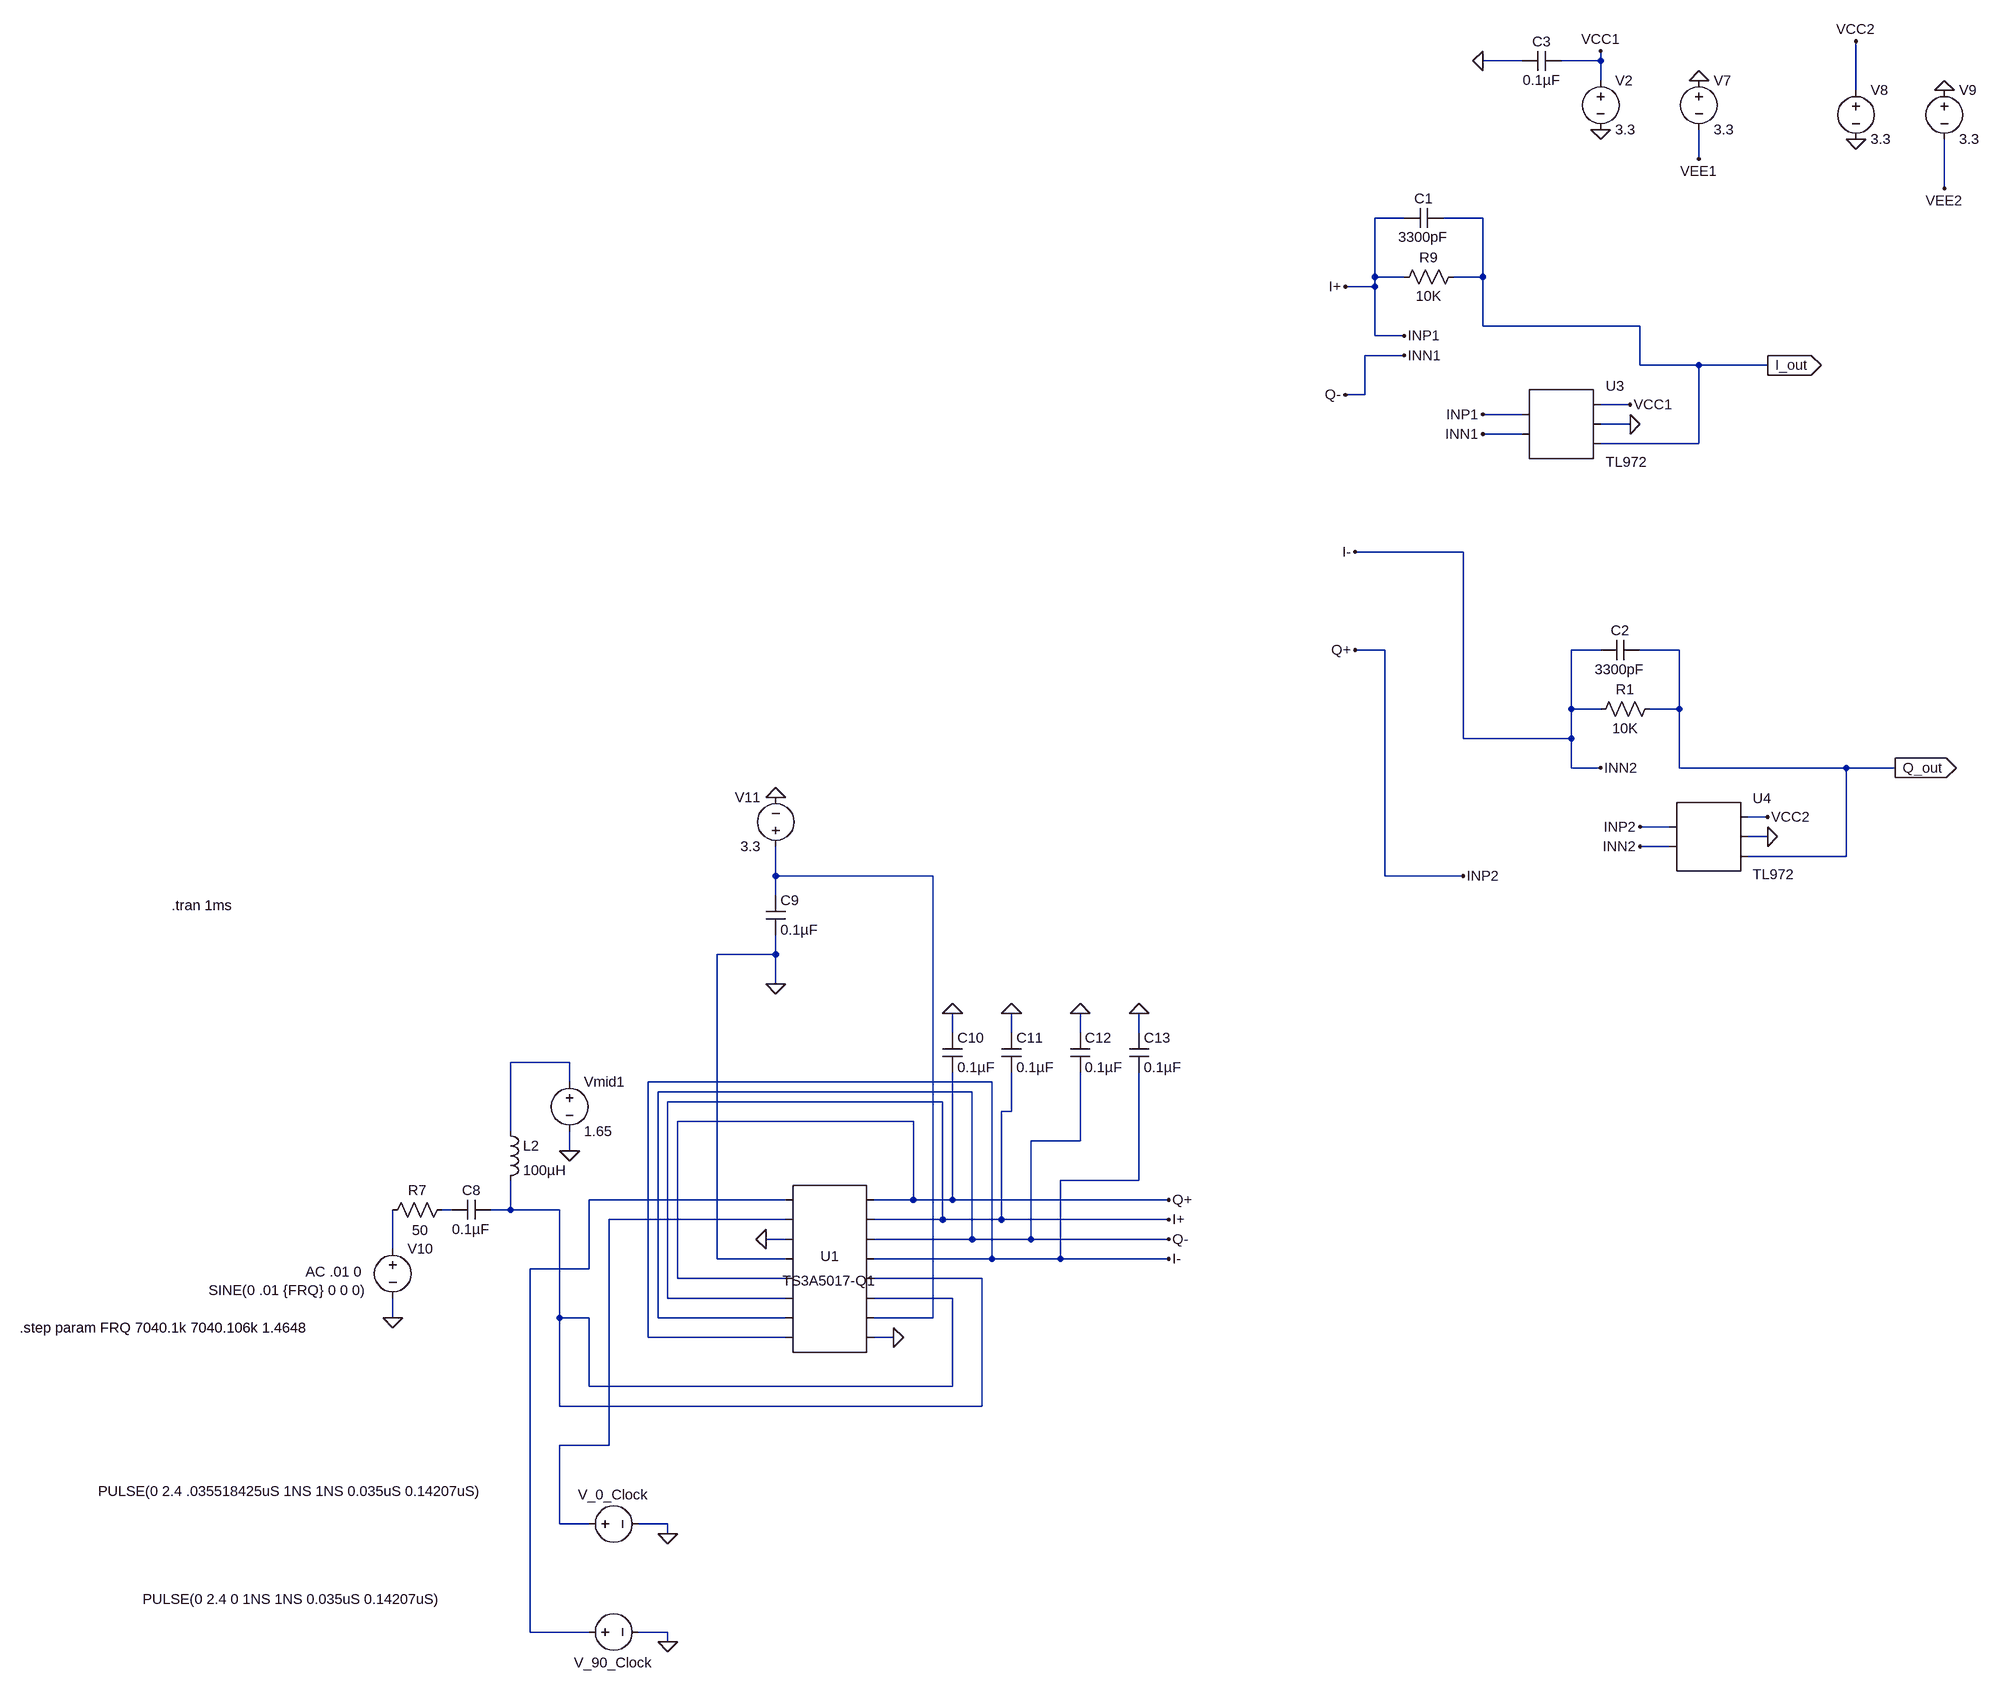
[diagram p0: schematic TS3A5017.asc]
TS3A5017.asc, the LTspice schematic file:
Version 4
SHEET 1 2336 2212
WIRE 224 -416 160 -416
WIRE 352 -416 352 -432
WIRE 352 -416 288 -416
WIRE 352 -384 352 -416
WIRE 768 -368 768 -448
WIRE 512 -256 512 -304
WIRE 912 -208 912 -288
WIRE 32 -160 -16 -160
WIRE 160 -160 96 -160
WIRE -16 -64 -16 -160
WIRE 32 -64 -16 -64
WIRE 160 -64 160 -160
WIRE 160 -64 112 -64
WIRE -16 -48 -16 -64
WIRE -16 -48 -64 -48
WIRE 160 16 160 -64
WIRE 416 16 160 16
WIRE -16 32 -16 -48
WIRE 32 32 -16 32
WIRE 32 64 -32 64
WIRE 416 80 416 16
WIRE 512 80 416 80
WIRE 624 80 512 80
WIRE -32 128 -32 64
WIRE -32 128 -64 128
WIRE 400 144 352 144
WIRE 224 160 160 160
WIRE 400 176 352 176
WIRE 224 192 160 192
WIRE 512 208 512 80
WIRE 512 208 352 208
WIRE 128 384 -48 384
WIRE 0 544 -48 544
WIRE 352 544 304 544
WIRE 480 544 416 544
WIRE 304 640 304 544
WIRE 352 640 304 640
WIRE 480 640 480 544
WIRE 480 640 432 640
WIRE 128 688 128 384
WIRE 304 688 304 640
WIRE 304 688 128 688
WIRE 304 736 304 688
WIRE 352 736 304 736
WIRE 480 736 480 640
WIRE 752 736 480 736
WIRE 832 736 752 736
WIRE 624 816 592 816
WIRE 464 832 416 832
WIRE 624 848 592 848
WIRE 464 864 416 864
WIRE 752 880 752 736
WIRE 752 880 592 880
WIRE -992 912 -992 864
WIRE -736 912 -992 912
WIRE 0 912 0 544
WIRE 128 912 0 912
WIRE -992 944 -992 912
WIRE -992 1040 -992 1008
WIRE -992 1040 -1088 1040
WIRE -992 1088 -992 1040
WIRE -704 1168 -704 1136
WIRE -608 1168 -608 1136
WIRE -496 1168 -496 1136
WIRE -400 1168 -400 1136
WIRE -1328 1216 -1424 1216
WIRE -1328 1248 -1328 1216
WIRE -640 1248 -1200 1248
WIRE -672 1264 -1184 1264
WIRE -720 1280 -1168 1280
WIRE -608 1296 -608 1232
WIRE -608 1296 -624 1296
WIRE -768 1312 -1152 1312
WIRE -1424 1328 -1424 1216
WIRE -496 1344 -496 1232
WIRE -496 1344 -576 1344
WIRE -1328 1360 -1328 1328
WIRE -400 1408 -400 1232
WIRE -400 1408 -528 1408
WIRE -976 1440 -1296 1440
WIRE -768 1440 -768 1312
WIRE -768 1440 -832 1440
WIRE -704 1440 -704 1232
WIRE -704 1440 -768 1440
WIRE -352 1440 -704 1440
WIRE -1520 1456 -1536 1456
WIRE -1424 1456 -1424 1408
WIRE -1424 1456 -1456 1456
WIRE -1344 1456 -1424 1456
WIRE -976 1472 -1264 1472
WIRE -720 1472 -720 1280
WIRE -720 1472 -832 1472
WIRE -624 1472 -624 1296
WIRE -624 1472 -720 1472
WIRE -352 1472 -624 1472
WIRE -976 1504 -1008 1504
WIRE -672 1504 -672 1264
WIRE -672 1504 -832 1504
WIRE -576 1504 -576 1344
WIRE -576 1504 -672 1504
WIRE -352 1504 -576 1504
WIRE -1616 1520 -1616 1456
WIRE -1088 1536 -1088 1040
WIRE -976 1536 -1088 1536
WIRE -640 1536 -640 1248
WIRE -640 1536 -832 1536
WIRE -528 1536 -528 1408
WIRE -528 1536 -640 1536
WIRE -352 1536 -528 1536
WIRE -1296 1552 -1296 1440
WIRE -1296 1552 -1392 1552
WIRE -1152 1568 -1152 1312
WIRE -976 1568 -1152 1568
WIRE -656 1568 -832 1568
WIRE -1168 1600 -1168 1280
WIRE -976 1600 -1168 1600
WIRE -704 1600 -832 1600
WIRE -1616 1632 -1616 1600
WIRE -1344 1632 -1344 1456
WIRE -1296 1632 -1344 1632
WIRE -1184 1632 -1184 1264
WIRE -976 1632 -1184 1632
WIRE -736 1632 -736 912
WIRE -736 1632 -832 1632
WIRE -1200 1664 -1200 1248
WIRE -976 1664 -1200 1664
WIRE -800 1664 -832 1664
WIRE -1296 1744 -1296 1632
WIRE -704 1744 -704 1600
WIRE -704 1744 -1296 1744
WIRE -1344 1776 -1344 1632
WIRE -656 1776 -656 1568
WIRE -656 1776 -1344 1776
WIRE -1264 1840 -1264 1472
WIRE -1264 1840 -1344 1840
WIRE -1344 1968 -1344 1840
WIRE -1296 1968 -1344 1968
WIRE -1168 1968 -1216 1968
WIRE -1168 1984 -1168 1968
WIRE -1392 2144 -1392 1552
WIRE -1296 2144 -1392 2144
WIRE -1168 2144 -1216 2144
WIRE -1168 2160 -1168 2144
FLAG 624 80 I_out
IOPIN 624 80 Out
FLAG 832 736 Q_out
IOPIN 832 736 Out
FLAG 352 -304 0
FLAG 512 -384 0
FLAG 32 32 INP1
FLAG 160 192 INN1
FLAG 32 64 INN1
FLAG 160 160 INP1
FLAG 352 -432 VCC1
FLAG 400 144 VCC1
FLAG 512 -256 VEE1
FLAG 352 736 INN2
FLAG 416 864 INN2
FLAG 416 832 INP2
FLAG 128 912 INP2
FLAG 768 -288 0
FLAG 912 -368 0
FLAG 768 -448 VCC2
FLAG 624 816 VCC2
FLAG 912 -208 VEE2
FLAG -1616 1632 0
FLAG -1328 1360 0
FLAG -800 1664 0
FLAG -1008 1504 0
FLAG -704 1136 0
FLAG -608 1136 0
FLAG -496 1136 0
FLAG -400 1136 0
FLAG -352 1440 Q+
FLAG -352 1472 I+
FLAG -352 1504 Q-
FLAG -352 1536 I-
FLAG -1168 1984 0
FLAG -1168 2160 0
FLAG -64 -48 I+
FLAG -48 384 I-
FLAG -48 544 Q+
FLAG -64 128 Q-
FLAG -992 784 0
FLAG 160 -416 0
FLAG -992 1088 0
FLAG 400 176 0
FLAG 624 848 0
SYMBOL cap 96 -176 R90
WINDOW 0 0 32 VBottom 2
WINDOW 3 32 32 VTop 2
SYMATTR InstName C1
SYMATTR Value 3300pF
SYMBOL res 128 -80 R90
WINDOW 0 0 56 VBottom 2
WINDOW 3 32 56 VTop 2
SYMATTR InstName R9
SYMATTR Value 10K
SYMATTR SpiceLine tol=1
SYMBOL cap 416 528 R90
WINDOW 0 0 32 VBottom 2
WINDOW 3 32 32 VTop 2
SYMATTR InstName C2
SYMATTR Value 3300pF
SYMBOL res 448 624 R90
WINDOW 0 0 56 VBottom 2
WINDOW 3 32 56 VTop 2
SYMATTR InstName R1
SYMATTR Value 10K
SYMATTR SpiceLine tol=1
SYMBOL AutoGenerated\\TL972 288 176 R0
SYMATTR InstName U3
SYMBOL AutoGenerated\\TL972 528 848 R0
SYMATTR InstName U4
SYMBOL voltage 352 -400 R0
WINDOW 123 0 0 Left 0
WINDOW 39 0 0 Left 0
SYMATTR InstName V2
SYMATTR Value 3.3
SYMBOL voltage 512 -400 R0
WINDOW 123 0 0 Left 0
WINDOW 39 0 0 Left 0
SYMATTR InstName V7
SYMATTR Value 3.3
SYMBOL voltage 768 -384 R0
WINDOW 123 0 0 Left 0
WINDOW 39 0 0 Left 0
SYMATTR InstName V8
SYMATTR Value 3.3
SYMBOL voltage 912 -384 R0
WINDOW 123 0 0 Left 0
WINDOW 39 0 0 Left 0
SYMATTR InstName V9
SYMATTR Value 3.3
SYMBOL voltage -1616 1504 R0
WINDOW 123 -142 53 Left 2
WINDOW 39 0 0 Left 0
WINDOW 3 -300 83 Left 2
SYMATTR Value2 AC .01 0
SYMATTR Value SINE(0 .01 {FRQ} 0 0 0)
SYMATTR InstName V10
SYMBOL res -1520 1440 R90
WINDOW 0 0 56 VBottom 2
WINDOW 3 34 51 VTop 2
SYMATTR InstName R7
SYMATTR Value 50
SYMBOL ind -1440 1312 R0
SYMATTR InstName L2
SYMATTR Value 100µH
SYMBOL cap -1456 1440 R90
WINDOW 0 0 32 VBottom 2
WINDOW 3 32 32 VTop 2
SYMATTR InstName C8
SYMATTR Value 0.1µF
SYMBOL voltage -1328 1232 R0
SYMATTR InstName Vmid1
SYMATTR Value 1.65
SYMATTR SpiceLine Rser=10
SYMBOL AutoGenerated\\TS3A5017-Q1 -912 1552 R0
SYMATTR InstName U1
SYMATTR ModelFile C:\Users\EG\Downloads\scdm196\TS3A5017_Q1_TINA_AIO\ts3a5017-q1.lib
SYMBOL voltage -992 880 R180
WINDOW 0 24 96 Left 2
WINDOW 3 24 16 Left 2
WINDOW 123 0 0 Left 0
WINDOW 39 0 0 Left 0
SYMATTR InstName V11
SYMATTR Value 3.3
SYMBOL cap -1008 944 R0
SYMATTR InstName C9
SYMATTR Value 0.1µF
SYMBOL cap -720 1168 R0
SYMATTR InstName C10
SYMATTR Value 0.1µF
SYMBOL cap -624 1168 R0
SYMATTR InstName C11
SYMATTR Value 0.1µF
SYMBOL cap -512 1168 R0
SYMATTR InstName C12
SYMATTR Value 0.1µF
SYMBOL cap -416 1168 R0
SYMATTR InstName C13
SYMATTR Value 0.1µF
SYMBOL voltage -1312 1968 R270
WINDOW 0 32 56 VTop 2
WINDOW 3 -107 -464 VBottom 2
WINDOW 123 0 0 Left 0
WINDOW 39 0 0 Left 0
SYMATTR InstName V_0_Clock
SYMATTR Value PULSE(0 2.4 0 1NS 1NS 0.035uS 0.14207uS)
SYMBOL voltage -1312 2144 R270
WINDOW 0 -66 56 VTop 2
WINDOW 3 245 -464 VBottom 2
WINDOW 123 0 0 Left 0
WINDOW 39 0 0 Left 0
SYMATTR InstName V_90_Clock
SYMATTR Value PULSE(0 2.4 .035518425uS 1NS 1NS 0.035uS 0.14207uS)
SYMBOL cap 288 -432 R90
WINDOW 0 0 32 VBottom 2
WINDOW 3 32 32 VTop 2
SYMATTR InstName C3
SYMATTR Value 0.1µF
TEXT -1976 960 Left 2 !.tran 1ms
TEXT -2224 1648 Left 2 !.step param FRQ 7040.1k 7040.106k 1.4648

The netlist it stands for:
* TS3A5017.asc
C1 I_out I+ 3300pF
R9 I_out I+ 10K tol=1
C2 Q_out I- 3300pF
R1 Q_out I- 10K tol=1
* U3: TL972 (symbol AutoGenerated\TL972 not available, pins judged from their places): pin1=I+ pin2=Q- pin3=VCC1 pin4=0 pin5=I_out
* U4: TL972 (symbol AutoGenerated\TL972 not available, pins judged from their places): pin1=Q+ pin2=I- pin3=VCC2 pin4=0 pin5=Q_out
V2 VCC1 0 3.3
V7 0 VEE1 3.3
V8 VCC2 0 3.3
V9 0 VEE2 3.3
V10 N007 0 SINE(0 .01 {FRQ} 0 0 0) AC .01 0
R7 N004 N007 50
L2 N002 N005 100µH
C8 N005 N004 0.1µF
Vmid1 N002 0 1.65 Rser=10
* U1: TS3A5017-Q1 (symbol AutoGenerated\TS3A5017-Q1 not available, pins judged from their places): pin1=N003 pin2=N006 pin3=0 pin4=0 pin5=Q+ pin6=I+ pin7=Q- pin8=I- pin9=Q+ pin10=I+ pin11=Q- pin12=I- pin13=N005 pin14=N005 pin15=N001 pin16=0
V11 N001 0 3.3
C9 N001 0 0.1µF
C10 0 Q+ 0.1µF
C11 0 I+ 0.1µF
C12 0 Q- 0.1µF
C13 0 I- 0.1µF
V_0_Clock N006 0 PULSE(0 2.4 0 1NS 1NS 0.035uS 0.14207uS)
V_90_Clock N003 0 PULSE(0 2.4 .035518425uS 1NS 1NS 0.035uS 0.14207uS)
C3 VCC1 0 0.1µF
.tran 1ms
.step param FRQ 7040.1k 7040.106k 1.4648
.lib C:\Users\EG\Downloads\scdm196\TS3A5017_Q1_TINA_AIO\ts3a5017-q1.lib
.backanno
.end